# Altium project Power.PrjPCB
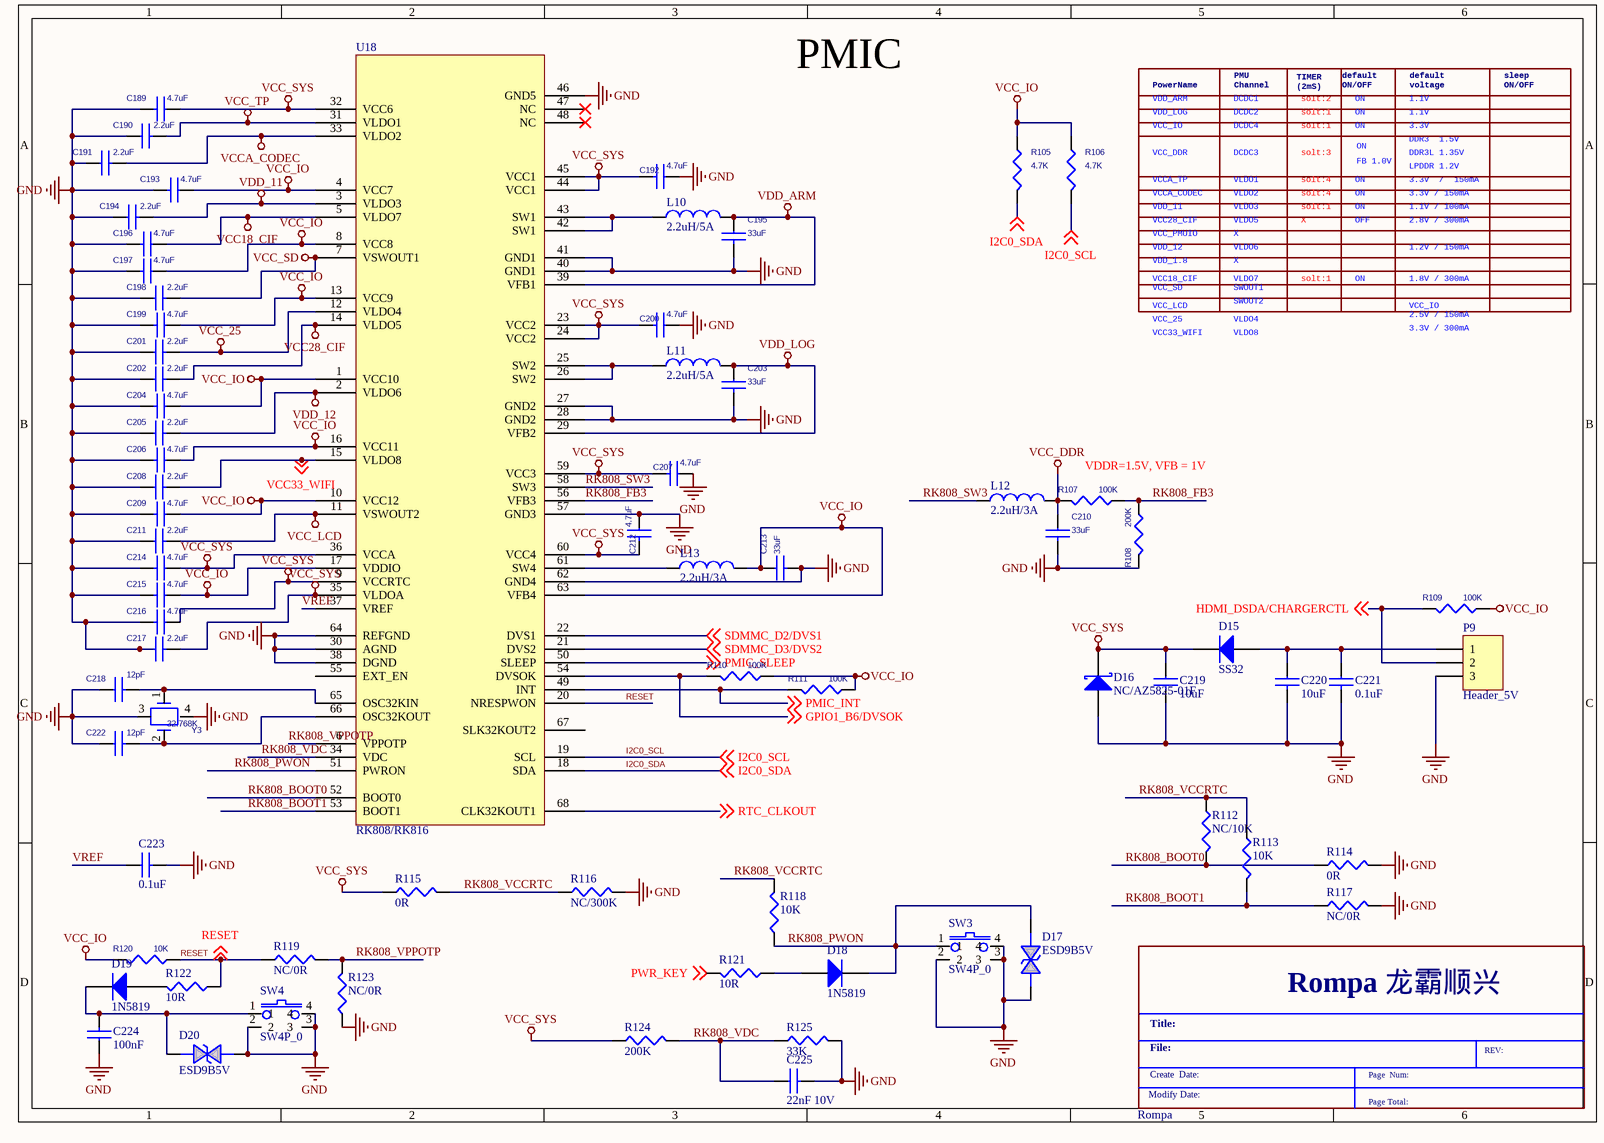
[diagram p0: Option_PMIC_RK808.SchDoc]
1 sheet, 74 parts. Net scope: global (net labels, ports and power ports of the same name join across sheets).

## Sheet Option_PMIC_RK808.SchDoc
size 297 x 209 mm

### Parts
*  Rompa  (graphical)
C189  4.7uF  [C0603]
C190  2.2uF  [C0402]
C191  2.2uF  [C0402]
C192  4.7uF  [C0603]
C193  4.7uF  [C0603]
C194  2.2uF  [C0402]
C195  33uF  [C0805]
C196  4.7uF  [C0603]
C197  4.7uF  [C0603]
C198  2.2uF  [C0402]
C199  4.7uF  [C0603]
C200  4.7uF  [C0603]
C201  2.2uF  [C0402]
C202  2.2uF  [C0402]
C203  33uF  [C0805]
C204  4.7uF  [C0603]
C205  2.2uF  [C0402]
C206  4.7uF  [C0603]
C207  4.7uF  [C0603]
C208  2.2uF  [C0402]
C209  4.7uF  [C0603]
C210  33uF  [C0805]
C211  2.2uF  [C0402]
C212  4.7uF  [C0603]
C213  33uF  [C0805]
C214  4.7uF  [C0603]
C215  4.7uF  [C0603]
C216  4.7uF  [C0603]
C217  2.2uF  [C0402]
C218  12pF  [C0402]
C219  10uF  [C0805]
C220  10uF  [C0805]
C221  0.1uF  [C0402]
C222  12pF  [C0402]
C223  0.1uF  [C0402]
C224  100nF  [C0402]
C225  22nF 10V  [C0402]
D15  SS32
D16  NC/AZ5825-01F
D17  ESD9B5V
D18  1N5819
D19  1N5819
D20  ESD9B5V
L10  2.2uH/5A
L11  2.2uH/5A
L12  2.2uH/3A
L13  2.2uH/3A
P9  Header_5V  [HDR1X3]
R105  4.7K  [R0402]
R106  4.7K  [R0402]
R107  100K  [R0402]
R108  200K  [R0402]
R109  100K  [R0402]
R110  100K  [R0402]
R111  100K  [R0402]
R112  NC/10K  [R0402]
R113  10K  [R0402]
R114  0R  [R0402]
R115  0R  [R0402]
R116  NC/300K  [R0402]
R117  NC/0R  [R0402]
R118  10K  [R0402]
R119  NC/0R  [R0402]
R120  10K  [R0402]
R121  10R  [R0402]
R122  10R  [R0402]
R123  NC/0R  [R0402]
R124  200K  [R0402]
R125  33K  [R0402]
SW3  SW4P_0
SW4  SW4P_0
U18  RK808/RK816
Y3  32.768K  [CRY_MC146]

### Nets
GND: C189.2 C190.1 C191.1 C192.1 C193.2 C194.1 C195.2 C196.2 C197.2 C198.1 C199.2 C200.1 C201.1 C202.1 C203.2 C204.2 C205.1 C206.2 C207.1 C208.1 C209.2 C210.2 C211.1 C212.1 C213.2 C214.2 C215.2 C216.2 C217.1 C218.1 C219.2 C220.2 C221.2 C222.1 C223.2 C224.1 C225.2 D16.1(A) D17.2 D20.2 P9.3 R108.1 R114.2 R116.2 R117.2 R123.1 R125.2 SW3.2 SW3.3 SW3.4 SW4.2 SW4.3 SW4.4 U18.27(GND2) U18.28(GND2) U18.30(AGND) U18.38(DGND) U18.40(GND1) U18.41(GND1) U18.46(GND5) U18.57(GND3) U18.62(GND4) U18.64(REFGND) Y3.3 Y3.4
VCC18_CIF: C196.1 U18.5(VLDO7)
VCC28_CIF: C202.2 U18.14(VLDO5)
VCC_25: C201.2 U18.12(VLDO4)
VCC_DDR: C210.1 L12.2 R107.1
VCC_IO: C193.1 C197.1 C199.1 C204.1 C206.1 C209.1 C213.1 C215.1 L13.2 R105.1 R106.1 R109.2 R110.2 R111.2 R120.1 U18.1(VCC10) U18.4(VCC7) U18.8(VCC8) U18.10(VCC12) U18.13(VCC9) U18.16(VCC11) U18.17(VDDIO) U18.63(VFB4)
VCC_LCD: C211.2 U18.11(VSWOUT2)
VCC_SD: C198.2 U18.7(VSWOUT1)
VCC_SYS: C189.1 C192.2 C200.2 C207.2 C212.2 C214.1 C216.1 C217.2 C219.1 D15.2(K) D16.3(K) R115.1 R124.1 U18.9(VCCRTC) U18.23(VCC2) U18.24(VCC2) U18.32(VCC6) U18.35(VLDOA) U18.36(VCCA) U18.44(VCC1) U18.45(VCC1) U18.59(VCC3) U18.60(VCC4)
VCC_TP: C190.2 U18.31(VLDO1)
VCCA_CODEC: C191.2 U18.33(VLDO2)
VDD_11: C194.2 U18.3(VLDO3)
VDD_12: C205.2 U18.2(VLDO6)
VDD_ARM: C195.1 L10.2 U18.39(VFB1)
VDD_LOG: C203.1 L11.2 U18.29(VFB2)
GPIO1_B6/DVSOK: R110.1 U18.54(DVSOK) ; off-sheet GPIO1_B6/DVSOK
HDMI_DSDA/CHARGERCTL: P9.2 R109.1 ; off-sheet HDMI_DSDA/CHARGERCTL
I2C0_SCL: R106.2 U18.19(SCL) ; off-sheet I2C0_SCL
I2C0_SDA: R105.2 U18.18(SDA) ; off-sheet I2C0_SDA
PMIC_INT: R111.1 U18.49(INT) ; off-sheet PMIC_INT
PMIC_SLEEP: U18.50(SLEEP) ; off-sheet PMIC_SLEEP
PWR_KEY: R121.2 ; off-sheet PWR_KEY
RESET: R119.1 R120.2 R122.1 U18.20(NRESPWON) ; off-sheet RESET
RK808_BOOT0: R112.2 R114.1 U18.52(BOOT0)
RK808_BOOT1: R113.2 R117.1 U18.53(BOOT1)
RK808_FB3: R107.2 R108.2 U18.56(VFB3)
RK808_PWON: D17.1 D18.2(K) R118.1 SW3.1 U18.51(PWRON)
RK808_SW3: L12.1 U18.58(SW3)
RK808_VCCRTC: R112.1 R113.1 R115.2 R116.1 R118.2
RK808_VDC: C225.1 R124.2 R125.1 U18.34(VDC)
RK808_VPPOTP: R119.2 R123.2 U18.6(VPPOTP)
RTC_CLKOUT: U18.68(CLK32KOUT1) ; off-sheet RTC_CLKOUT
SDMMC_D2/DVS1: U18.22(DVS1) ; off-sheet SDMMC_D2/DVS1
SDMMC_D3/DVS2: U18.21(DVS2) ; off-sheet SDMMC_D3/DVS2
VCC33_WIFI: C208.2 U18.15(VLDO8) ; off-sheet VCC33_WIFI
VREF: C223.1 U18.37(VREF)
NetC218_2: C218.2 U18.65(OSC32KIN) Y3.1
NetC220_1: C220.1 C221.1 D15.1(A) P9.1
NetC222_2: C222.2 U18.66(OSC32KOUT) Y3.2
NetC224_2: C224.2 D19.2(K) D20.1 SW4.1
NetD18_1: D18.1(A) R121.1
NetD19_1: D19.1(A) R122.2
NetL10_1: L10.1 U18.42(SW1) U18.43(SW1)
NetL11_1: L11.1 U18.25(SW2) U18.26(SW2)
NetL13_1: L13.1 U18.61(SW4)

Not connected (* = marked no-connect by the designer): U18 47(NC)* 48(NC)* 55(EXT_EN) 67(SLK32KOUT2)

### Notes on the sheet
- PMIC
- VDD_ARM
- VCC_IO
- PowerName
- VDD_LOG
- DCDC4
- PMU
  Channel
- DCDC2
- DCDC1
- TIMER
  (2mS)
- solt:1
- solt:2
- default
  ON/OFF
- ON
- default
  voltage
- 1.1V
- 3.3V
- sleep
  ON/OFF
- VCC_DDR
- VCCA_TP
- VCCA_CODEC
- DCDC3
- VLDO2
- VLDO1
- solt:3
- solt:4
- FB 1.0V
- DDR3  1.5V
- 3.3V  /  150mA
- LPDDR 1.2V
- DDR3L 1.35V
- 3.3V / 150mA
- VDD_11
- VCC28_CIF
- VCC_PMUIO
- VDD_12
- VDD_1.8
- VLDO5
- VLDO3
- X
- VLDO6
- OFF
- 1.1V / 100mA
- 2.8V / 300mA
- 1.2V / 150mA
- VCC_LCD
- VCC18_CIF
- VCC_SD
- VCC_25
- VCC33_WIFI
- VLDO7
- SWOUT1
- SWOUT2
- VLDO4
- VLDO8
- 1.8V / 300mA
- 2.5V / 150mA
- 3.3V / 300mA
- VDDR=1.5V, VFB = 1V
- (in symbol Rompa) Rompa 龙霸顺兴; Title:; File:; REV:; Create  Date:; Page  Num:; Modify Date:; Page Total:

### Library data of the parts
C189-C218 C222 = CAP NP_4
C219 C220 = CAP NP_Dup1: 10V X5R
C221 C223 C225 = CAP NP
C224 = CAP NP: 16V X7R
D15 = Diode: SOD123; Published: 8-Jun-2000; LatestRevisionDate: 17-Jul-2002; LatestRevisionNote: Re-released for DXP Platform.; PackageDocument: Sep-1996; PackageReference: SMC; Publisher: Altium Limited; Code_JEDEC: DO-214-AB
D16 = Diode BAS70: AMAZING, FP:DFN1006P2E; Note: Pin 2 is not connected and not drawn.; Published: 21-Mar-2003; DatasheetDocument: Oct-1999; PackageDocument: Sep-2001; PackageReference: SOT-23; Publisher: Altium Limited; ComponentLink1Description: Manufacturer Link; ComponentLink1URL: http://www.infineon.com/; ComponentLink2Description: Datasheet; ComponentLink2URL: http://www.infineon.com/upload/Document/cmc_upload/documents/009/382/bas40_bas140series_1.pdf
D17 D20 = DIODE BI-DIR TRIG: FP:E0402N
D18 D19 = Diode: Published: 8-Jun-2000; LatestRevisionDate: 17-Jul-2002; LatestRevisionNote: Re-released for DXP Platform.; PackageDocument: Sep-1996; PackageReference: SMC; Publisher: Altium Limited; Code_JEDEC: DO-214-AB
L10-L13 = Inductor
P9 = Header 3: Header, 3-Pin; LatestRevisionDate: 17-Jul-2002; LatestRevisionNote: Re-released for DXP Platform.; Publisher: Altium Limited
R105 R106 = RES 1B: ROHS CHIP RES 4.7K 1/16W 5%
R107 R108 = RESISTOR_1: %1
R109-R111 R120 = RESISTOR_1: RES,thick film,47KOhm,+/-5%,1/16W,SMD0402
R112-R119 R121-R125 = RESISTOR
U18 = RK808
Y3 = CRYSTAL_0: Crystal,32.768KHz,+/-30ppm,12pF,MC146,-10°C ~ +60   °C; Part Type: 晶体类\无源晶体